# EAGLE design ESP_RAMPS (EAGLE 7.2.0)
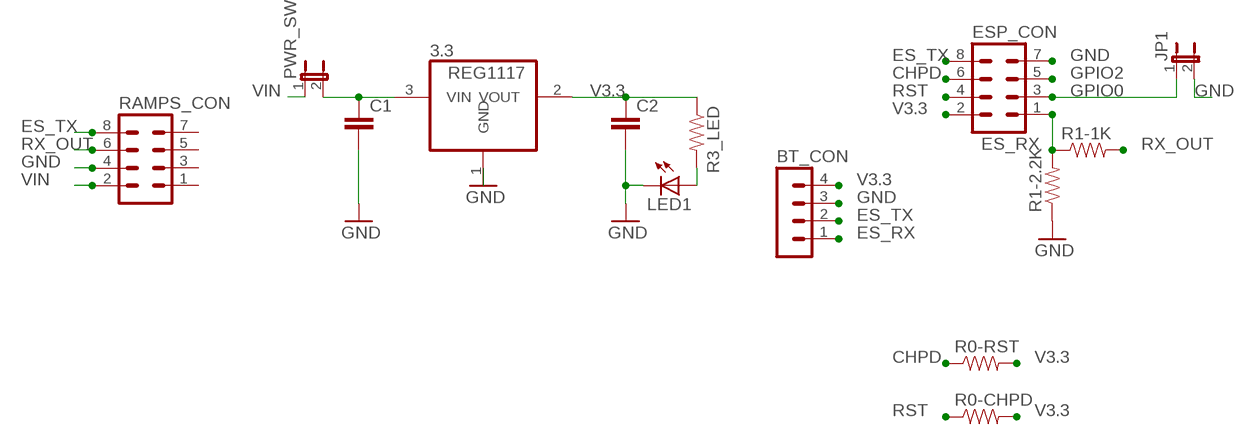
[diagram p0: schematic, sheet 1]

## Parts
3.3  REG1117  [SOT223]
BT_CON  MA04-1  [MA04-1]
C1  CAP1206  [1206]
C2  CAP1206  [1206]
ESP_CON  MA04-2  [MA04-2]
JP1  JUMPER-2PTH  [1X02]
LED1  LED1206  [LED-1206]
PWR_SW  JUMPER-2PTH  [1X02]
R0-CHPD  RESISTOR1206  [1206]
R0-RST  RESISTOR1206  [1206]
R1-1K  RESISTOR1206  [1206]
R1-2.2K  RESISTOR1206  [1206]
R3_LED  RESISTOR1206  [1206]
RAMPS_CON  MA04-2  [MA04-2]

## Nets
CHPD: ESP_CON.6 R0-RST.1
ES_RX: BT_CON.1 ESP_CON.1 R1-1K.1 R1-2.2K.2
ES_TX: BT_CON.2 ESP_CON.8 RAMPS_CON.8
GND: 3.3.1(GND) BT_CON.3 C1.2 C2.2 ESP_CON.7 JP1.2 LED1.C R1-2.2K.1 RAMPS_CON.4
GPIO0: ESP_CON.3 JP1.1
GPIO2: ESP_CON.5
N$1: LED1.A R3_LED.2
N$2: 3.3.3(VIN) C1.1 PWR_SW.2
RST: ESP_CON.4 R0-CHPD.1
RX_OUT: R1-1K.2 RAMPS_CON.6
V3.3: 3.3.2(VOUT) BT_CON.4 C2.1 ESP_CON.2 R0-CHPD.2 R0-RST.2 R3_LED.1
VIN: PWR_SW.1 RAMPS_CON.2
Unconnected: RAMPS_CON.1 RAMPS_CON.3 RAMPS_CON.5 RAMPS_CON.7

## Library data of the parts
3.3 = burr-brown:REG1117: 800mA and 1A Low Dropout (LDO) Positive Regulator 1.8V, 2.5V, 2.85V, 3.3V, 5V, and Adj; MPN: REG1117; OC_FARNELL: 1097566; OC_NEWARK: 14P6981
BT_CON = con-lstb:MA04-1: PIN HEADER; OC_FARNELL: unknown; OC_NEWARK: unknown
C1 C2 = SparkFun:CAP: Capacitor Standard 0603 ceramic capacitor, and 0.1" leaded capacitor.
ESP_CON RAMPS_CON = con-lstb:MA04-2: PIN HEADER; OC_FARNELL: unknown; OC_NEWARK: unknown
JP1 PWR_SW = SparkFun:JUMPER-2: Jumper Basic 0.1" spaced jumper. Use with breakaway headers.
LED1 = SparkFun:LED: LEDs Standard schematic elements and footprints for 5mm, 3mm, 1206, and 0603 sized LEDs. 5mm - Spark Fun Electronics SKU : COM-00529 (and others)
R0-CHPD R0-RST R1-1K R1-2.2K R3_LED = SparkFun:RESISTOR: Resistor Basic schematic elements and footprints for 0603, 1206, and PTH resistors.

## Board
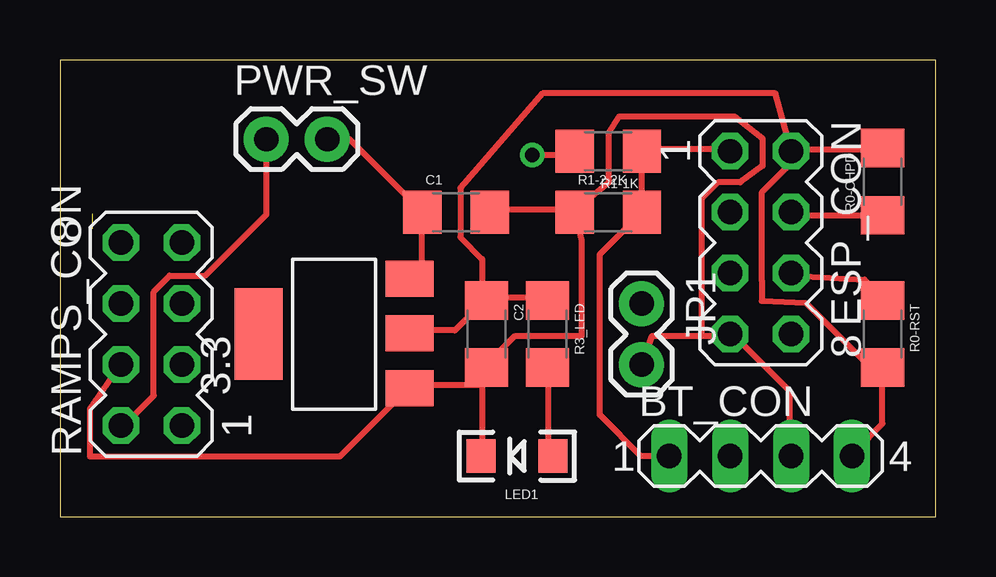
[diagram p1: board, top side]
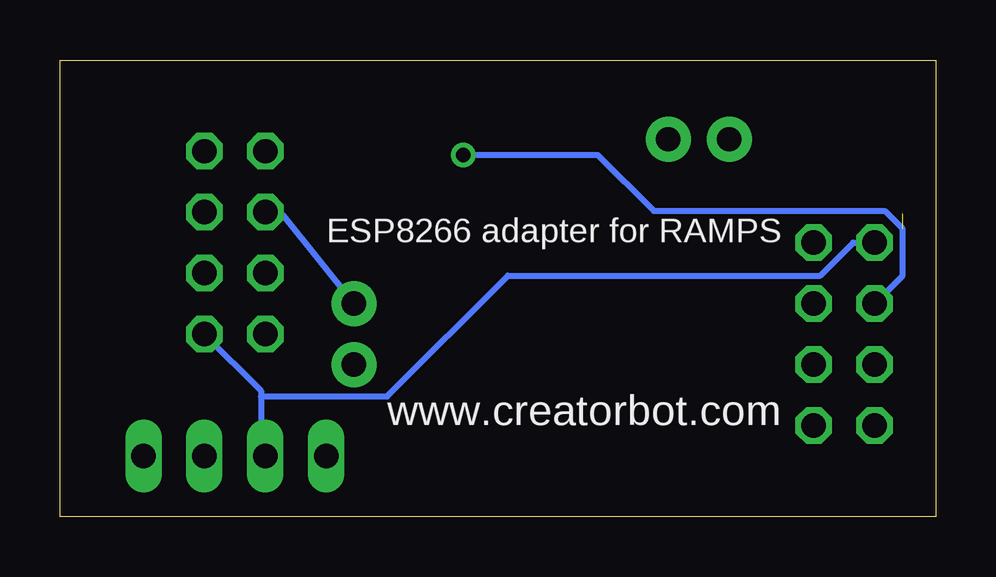
[diagram p2: board, bottom side, seen from below]

Size 36.5 x 19.04 mm. Coordinates in mm from the lower left corner, seen from the top.
Outline: 0,0 36.5,0 36.5,19.04 0,19.04 0,0
Copper layers (1*16): Top 0.035mm / dielectric 1.5mm / Bottom 0.035mm
Design rules "default *": minimum track width 10mil, minimum drill 24mil, track to track 10mil, track to pad 10mil, pad to pad 10mil, via to via 10mil, smd to smd 10mil, copper to edge 40mil, drill to drill 10mil, minimum pad ring 10mil, minimum via ring 8mil, stop-mask expansion 4mil, vias tented up to drill 0mil, thermal gap 10mil

### Footprints (pad centres in the part's own frame; a part is rotated, then mirrored left to right if it is on the bottom)
SOT223 = smd 1.499 x 2.007: 1 -2.261,-3.15; 2 0.025,-3.15; 3 2.311,-3.15 | smd 3.81 x 2.007: 4 0,3.15
MA04-1 = drill 1.016 long: 1 -3.81,0; 2 -1.27,0; 3 1.27,0; 4 3.81,0
1206 = smd 1.6 x 1.8: 1 -1.4,0; 2 1.4,0
MA04-2 = drill 1.016 octagon: 1 -3.81,-1.27; 2 -3.81,1.27; 3 -1.27,-1.27; 4 -1.27,1.27; 5 1.27,-1.27; 6 1.27,1.27; 7 3.81,-1.27; 8 3.81,1.27
1X02 = drill 1.016 pad 1.88: 1 0,0; 2 2.54,0
LED-1206 = smd 1.2 x 1.4: A -1.5,0; C 1.5,0

### Placement (x,y rotation side)
3.3  11.43,7.62 90 top
BT_CON  29.21,2.54 0 top
C1  16.51,12.7 0 top
C2  17.78,7.62 270 top
ESP_CON  29.21,11.43 270 top
JP1  24.25,8.89 270 top
LED1  19.05,2.54 180 top
PWR_SW  8.6,15.74 0 top
R0-CHPD  34.29,13.97 90 top
R0-RST  34.29,7.62 270 top
R1-1K  22.86,15.24 180 top
R1-2.2K  22.86,12.7 0 top
R3_LED  20.32,7.62 270 top
RAMPS_CON  3.81,7.62 90 top

### Tracks (layer width: path | path; a pad name or v marks a point on that pad's centre or on a via)
CHPD
  Top 0.254: R0-RST.1 34.29,9.14 33.55,9.89 30.63,10.06 ESP_CON.6
ES_RX
  Top 0.254: ESP_CON.1 27.89,15.32 24.46,15.32 R1-1K.1 24.23,15.09 24.23,12.8 R1-2.2K.2 22.5,10.94 22.5,4.25 24.21,2.54 BT_CON.1
ES_TX
  Bottom 0.254: 28.12,5.03 28.12,5.26 ESP_CON.8 | 28.12,5.03 28.12,2.74 BT_CON.2 | RAMPS_CON.8 3.43,11.43 4.8,10.06 17.83,10.06 22.86,5.03 28.12,5.03
GND
  Top 0.254: 26.75,7.54 24.69,7.54 JP1.2 | 26.75,7.54 27.89,7.54 ESP_CON.7 28.12,7.54 30.4,5.26 30.4,2.74 BT_CON.3 | C1.2 18.06,12.8 21.26,12.8 R1-2.2K.1 | 17.6,5.49 17.6,6.17 C2.2 | 17.6,5.49 17.6,2.74 LED1.C | 17.6,5.49 14.63,5.49 3.3.1 14.4,5.26 11.66,2.52 1.25,2.52 1.25,4.5 RAMPS_CON.4 2.52,6.17 | 17.6,5.49 C2.2 | 21.49,12.57 R1-2.2K.1 | C2.2 17.83,6.4 18.97,7.54 21.75,7.54 21.75,11.5 R1-2.2K.1 | 26.75,7.54 26.75,13.26 27.43,13.95 28.35,13.95 29.28,14.63 29.28,15.77 28.12,16.69 23.32,16.69 22.88,16 22.88,13.95 21.49,12.8 R1-2.2K.1
GPIO0
  Bottom 0.254: ESP_CON.3 27.89,12.57 27.2,12.57 JP1.1
N$1
  Top 0.254: LED1.A 20.34,2.74 20.34,6.17 R3_LED.2
N$2
  Top 0.254: 3.3.3 14.63,10.06 15.09,10.52 15.09,12.57 C1.1 12.07,15.74 PWR_SW.2
RST
  Top 0.254: R0-CHPD.1 30.63,12.57 ESP_CON.4
RX_OUT  (via drill 0.61)  (1 unrouted)
  Top 0.254: v19.68,15.09 21.26,15.09 R1-1K.2
  Bottom 0.254: RAMPS_CON.6 1.37,10.06 1.37,12 2.12,12.75 11.75,12.75 14.09,15.09 v19.68,15.09
V3.3
  Top 0.254: C2.1 17.83,9.14 20.12,9.14 R3_LED.1 | 3.3.2 14.63,7.77 16.46,7.77 17.6,8.91 C2.1 | R0-CHPD.2 34.29,15.32 30.63,15.32 ESP_CON.2 | BT_CON.4 33.15,2.74 34.29,3.89 R0-RST.2 34.29,6.4 33.6,6.4 31.09,8.91 29.25,9 29.26,9.83 29.26,13.53 30.4,14.67 30.4,15.09 ESP_CON.2 | ESP_CON.2 29.82,17.64 20.12,17.64 16.69,13.72 16.69,11.66 17.6,10.74 17.6,9.14 C2.1
VIN
  Top 0.254: RAMPS_CON.2 2.74,3.89 3.91,5.05 3.91,9.39 4.57,10.06 6.06,10.06 8.6,12.6 PWR_SW.1

### Text on the board
bPlace: ESP8266 adapter for RAMPS | www.creatorbot.com